# EAGLE design ad (EAGLE 9.3.0)
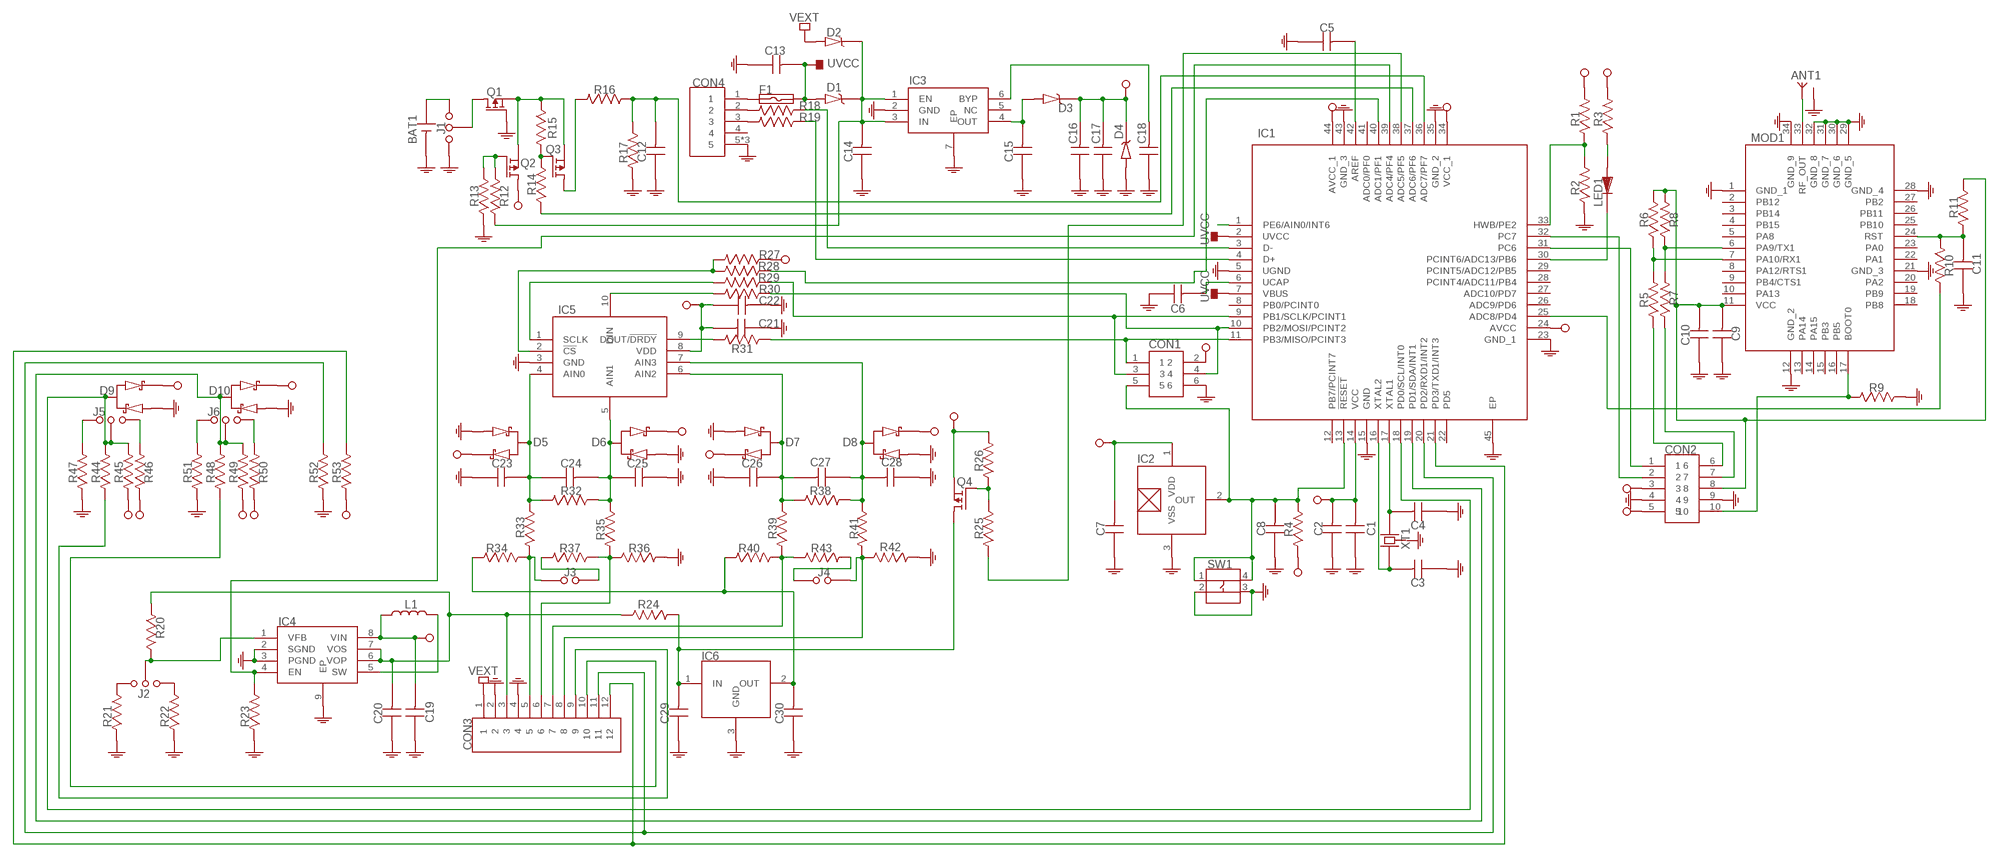
[diagram p0: schematic, sheet 1]

## Parts
ANT1  SMA-RF  [SMA-RF]
BAT1  211P-C-HOLDER  [211P-C-HOLDER]
C1  CAPACITOR-0603  [0603]
C2  CAPACITOR-0603  [0603]
C3  CAPACITOR-0603  [0603]
C4  CAPACITOR-0603  [0603]
C5  CAPACITOR-0603  [0603]
C6  CAPACITOR-0603  [0603]
C7  CAPACITOR-0603  [0603]
C8  CAPACITOR-0603  [0603]
C9  CAPACITOR-0603  [0603]
C10  CAPACITOR-0603  [0603]
C11  CAPACITOR-0603  [0603]
C12  CAPACITOR-0603  [0603]
C13  CAPACITOR-0603  [0603]
C14  CAPACITOR-0805  [0805]
C15  CAPACITOR-0805  [0805]
C16  CAPACITOR-0603  [0603]
C17  CAPACITOR-0603  [0603]
C18  CAPACITOR-0603  [0603]
C19  CAPACITOR-0805  [0805]
C20  CAPACITOR-0805  [0805]
C21  CAPACITOR-0603  [0603]
C22  CAPACITOR-0603  [0603]
C23  CAPACITOR-0603  [0603]
C24  CAPACITOR-0603  [0603]
C25  CAPACITOR-0603  [0603]
C26  CAPACITOR-0603  [0603]
C27  CAPACITOR-0603  [0603]
C28  CAPACITOR-0603  [0603]
C29  CAPACITOR-0603  [0603]
C30  CAPACITOR-0603  [0603]
CON1  ISP  [ISP]
CON2  HEADER-10P-2R-DIP-2_54MM  [HEADER-10P-2R-DIP-2_54MM]
CON3  CON-12P-2_54MM-141V  [CON-12P-2_54MM-141V]
CON4  USB-MICRO-DIP-VER  [USB-MICRO-DIP-VER]
D1  DIODE-SCHOTTKY  [SOD123-DIODE]
D2  DIODE-SCHOTTKY  [SOD123-DIODE]
D3  DIODE-SCHOTTKY  [SOD123-DIODE]
D4  ZENER-SOD123  [SOD123-DIODE]
D5  SCHOTTKY-SERIE-3P  [SOT23-3]
D6  SCHOTTKY-SERIE-3P  [SOT23-3]
D7  SCHOTTKY-SERIE-3P  [SOT23-3]
D8  SCHOTTKY-SERIE-3P  [SOT23-3]
D9  SCHOTTKY-SERIE-3P  [SOT23-3]
D10  SCHOTTKY-SERIE-3P  [SOT23-3]
F1  FUSE-1206  [1206]
IC1  ATMEGA32U4-MU  [QFN-44]
IC2  S-5712-SOT23-3  [SOT23-3]
IC3  MIC5219-VDFN-6  [VDFN-6]
IC4  MCP1640-DFN-8  [DFN-8-2X3]
IC5  ADS1118IRUGT  [X2QFN-10]
IC6  VREF-SOT23-3  [SOT23-3]
J1  JUMPER-3P  [HEADER-3P-DIP-2_54MM]
J2  JUMPER-3P  [HEADER-3P-DIP-2_54MM]
J3  JUMPER  [HEADER-2P-DIP-2_54MM]
J4  JUMPER  [HEADER-2P-DIP-2_54MM]
J5  JUMPER-3P  [HEADER-3P-DIP-2_54MM]
J6  JUMPER-3P  [HEADER-3P-DIP-2_54MM]
L1  INDUCTOR-0520-0630  [INDUCTOR-0520-0630]
LED1  LED-0805  [LED-0805]
MOD1  RAK811  [RAK811]
Q1  P-MOSFET  [SOT23-3]
Q2  P-MOSFET  [SOT23-3]
Q3  P-MOSFET  [SOT23-3]
Q4  P-MOSFET  [SOT23-3]
R1  RESISTOR-0603  [0603]
R2  RESISTOR-0603  [0603]
R3  RESISTOR-0603  [0603]
R4  RESISTOR-0603  [0603]
R5  RESISTOR-0603  [0603]
R6  RESISTOR-0603  [0603]
R7  RESISTOR-0603  [0603]
R8  RESISTOR-0603  [0603]
R9  RESISTOR-0603  [0603]
R10  RESISTOR-0603  [0603]
R11  RESISTOR-0603  [0603]
R12  RESISTOR-0603  [0603]
R13  RESISTOR-0603  [0603]
R14  RESISTOR-0603  [0603]
R15  RESISTOR-0603  [0603]
R16  RESISTOR-0603  [0603]
R17  RESISTOR-0603  [0603]
R18  RESISTOR-0603  [0603]
R19  RESISTOR-0603  [0603]
R20  RESISTOR-0603  [0603]
R21  RESISTOR-0603  [0603]
R22  RESISTOR-0603  [0603]
R23  RESISTOR-0603  [0603]
R24  RESISTOR-0603  [0603]
R25  RESISTOR-0603  [0603]
R26  RESISTOR-0603  [0603]
R27  RESISTOR-0603  [0603]
R28  RESISTOR-0603  [0603]
R29  RESISTOR-0603  [0603]
R30  RESISTOR-0603  [0603]
R31  RESISTOR-0603  [0603]
R32  RESISTOR-0805  [0805]
R33  RESISTOR-0805  [0805]
R34  RESISTOR-0805  [0805]
R35  RESISTOR-0805  [0805]
R36  RESISTOR-0805  [0805]
R37  RESISTOR-0805  [0805]
R38  RESISTOR-0805  [0805]
R39  RESISTOR-0805  [0805]
R40  RESISTOR-0805  [0805]
R41  RESISTOR-0805  [0805]
R42  RESISTOR-0805  [0805]
R43  RESISTOR-0805  [0805]
R44  RESISTOR-0805  [0805]
R45  RESISTOR-0603  [0603]
R46  RESISTOR-0805  [0805]
R47  RESISTOR-0805  [0805]
R48  RESISTOR-0805  [0805]
R49  RESISTOR-0603  [0603]
R50  RESISTOR-0805  [0805]
R51  RESISTOR-0805  [0805]
R52  RESISTOR-0603  [0603]
R53  RESISTOR-0603  [0603]
SW1  BUTTON-4P-SMD-5X5  [BUTTON-4P-SMD-5X5]
XT1  CRYSTAL-5032-4P  [CRYSTAL-5032-4P]

## Nets
GND: ANT1.2(GND) ANT1.3(GND) ANT1.4(GND) ANT1.5(GND) BAT1.2(-) C1.1 C2.1 C3.1 C4.1 C5.1 C6.1 C7.1 C8.1 C9.1 C10.1 C11.1 C12.1 C13.1 C14.1 C15.1 C16.1 C17.1 C18.1 C19.1 C20.1 C21.1 C22.2 C23.1 C25.2 C26.1 C28.1 C29.1 C30.1 CON1.6 CON2.4 CON2.9 CON3.2 CON3.4 CON4.5 CON4.6 CON4.7 D4.2(A) D5.1 D6.1 D7.1 D8.1 D9.1 D10.1 IC1.5(UGND) IC1.15(GND) IC1.23(GND_1) IC1.35(GND_2) IC1.43(GND_3) IC1.45(EP) IC2.3(VSS) IC3.2(GND) IC3.7(EP) IC4.2(SGND) IC4.3(PGND) IC4.9(EP) IC5.3(GND) IC6.3(GND) J1.1 MOD1.1(GND_1) MOD1.12(GND_2) MOD1.21(GND_3) MOD1.28(GND_4) MOD1.29(GND_5) MOD1.30(GND_6) MOD1.31(GND_7) MOD1.32(GND_8) MOD1.34(GND_9) Q1.1(G) R2.1 R9.2 R13.1 R17.1 R21.1 R22.1 R23.1 R36.1 R42.1 R47.1 R51.1 R52.1 SW1.2 SW1.3
N$1: IC5.1(SCLK) R29.2
N$2: C11.2 MOD1.24(RST) R10.1 R11.1
N$3: CON1.1 IC1.11(PB3/MISO/PCINT3) R31.2
N$4: ANT1.1(ANT) MOD1.33(RF_OUT)
N$5: CON3.5 J3.1 R33.1 R34.2
N$6: MOD1.7(PA10/RX1) R5.2 R6.1
N$7: MOD1.6(PA9/TX1) R7.2 R8.1
N$8: IC5.2(!CS) R27.1 R28.2
N$9: CON1.4 IC1.10(PB2/MOSI/PCINT2) R30.2
N$10: C3.2 IC1.16(XTAL2) XT1.1
N$11: CON2.1 IC1.31(PC6)
N$12: C4.2 IC1.17(XTAL1) XT1.3
N$13: C9.2 C10.2 CON2.8 MOD1.11(VCC) R6.2 R8.2 R11.2
N$14: CON2.7 R7.1
N$15: C20.2 CON3.3 IC4.6(VOP) IC4.7(VOS) R20.1 R24.2
N$16: IC1.25(ADC8/PD4) R10.2
N$17: IC5.10(DIN) R30.1
N$18: IC5.9(DOUT/!DRDY) R31.1
N$19: IC1.30(PCINT6/ADC13/PB6) LED1.1(K)
N$20: CON3.7 R39.1 R40.2 R43.2
N$21: CON3.6 R35.1 R36.2 R37.2
N$22: IC4.1(VFB) J2.2 R20.2
N$23: C24.2 C25.1 D6.3 IC5.5(AIN1) R32.2 R35.2
N$24: C23.2 C24.1 D5.3 IC5.4(AIN0) R32.1 R33.2
N$25: CON3.8 J4.1 R41.1 R42.2
N$26: C26.2 C27.2 D7.3 IC5.6(AIN2) R38.2 R39.2
N$27: IC1.40(ADC1/PF1) R28.1
N$28: C29.2 IC6.1(IN) Q4.3(D) R24.1
N$29: CON2.2 IC1.32(PC7)
N$30: C27.1 C28.2 D8.3 IC5.7(AIN3) R38.1 R41.2
N$31: C5.2 IC1.42(AREF)
N$32: Q3.1(G) R14.2 R15.2
N$33: CON4.1 F1.1
N$34: C6.2 IC1.6(UCAP)
N$35: LED1.2(A) R3.1
N$36: C12.2 IC1.36(ADC7/PF7) R16.2 R17.2
N$37: C18.2 IC3.6(BYP)
N$38: C14.2 D1.1(K) D2.1(K) IC3.1(EN) IC3.3(IN) R12.1
N$39: J2.1 R22.2
N$40: C15.2 D3.2(A) IC3.4(OUT)
N$41: CON4.2 R18.1
N$42: CON4.3 R19.1
N$43: IC1.3(D-) R18.2
N$44: IC1.4(D+) R19.2
N$45: CON1.3 IC1.9(PB1/SCLK/PCINT1) R29.1
N$46: Q4.1(G) R25.2 R26.1
N$47: IC1.37(ADC6/PF6) R14.1
N$48: J1.2 Q1.3(D)
N$49: J2.3 R21.2
N$50: IC1.38(ADC5/PF5) R25.1
N$51: BAT1.1(+) J1.3
N$52: D9.3 IC1.18(PD0/SCL/INT0) J5.2 R44.2 R45.2
N$53: Q2.1(G) R12.2 R13.2
N$54: D10.3 IC1.19(PD1/SDA/INT1) J6.2 R48.2 R49.2
N$55: CON3.12 IC1.21(PD3/TXD1/INT3) R53.2
N$56: C30.2 IC6.2(OUT) R34.1 R40.1
N$58: Q1.2(S) Q2.2(S) Q3.2(S) R15.1
N$59: Q3.3(D) R16.1
N$60: CON2.6 R5.1
N$61: IC1.33(HWB/PE2) R1.1 R2.2
N$63: CON2.10 MOD1.17(BOOT0) R9.1
N$64: C8.2 CON1.5 IC1.13(!RESET) IC2.2(OUT) R4.2 SW1.1 SW1.4
N$65: IC4.5(SW) L1.2
N$66: IC1.39(ADC4/PF4) IC4.4(EN) R23.2
N$67: IC1.1(PE6/AIN0/INT6)
N$68: CON3.11 IC1.20(PD2/RXD1/INT2) R52.2
N$69: J4.2 R43.1
N$70: CON3.10 R48.1
N$71: J3.2 R37.1
N$72: CON3.9 R44.1
N$74: J6.1 R51.2
N$75: J6.3 R50.2
N$76: J5.1 R47.2
N$78: J5.3 R46.2
UVCC: C13.2 D1.2(A) F1.2 IC1.2(UVCC) IC1.7(VBUS)
VCC: C1.2 C2.2 C7.2 C16.2 C17.2 C19.2 C21.2 C22.1 CON1.2 CON2.3 CON2.5 D3.1(K) D4.1(K) D5.2 D6.2 D7.2 D8.2 D9.2 D10.2 IC1.14(VCC) IC1.24(AVCC) IC1.34(VCC_1) IC1.44(AVCC_1) IC2.1(VDD) IC4.8(VIN) IC5.8(VDD) L1.1 Q2.3(D) Q4.2(S) R1.2 R3.2 R4.1 R26.2 R27.2 R45.1 R46.1 R49.1 R50.1 R53.1
VEXT: CON3.1 D2.2(A)
Unconnected: CON4.4 IC1.8(PB0/PCINT0) IC1.12(PB7/PCINT7) IC1.22(PD5) IC1.26(ADC9/PD6) IC1.27(ADC10/PD7) IC1.28(PCINT4/ADC11/PB4) IC1.29(PCINT5/ADC12/PB5) IC1.41(ADC0/PF0) IC3.5(NC) MOD1.2(PB12) MOD1.3(PB14) MOD1.4(PB15) MOD1.5(PA8) MOD1.8(PA12/RTS1) MOD1.9(PB4/CTS1) MOD1.10(PA13) MOD1.13(PA14) MOD1.14(PA15) MOD1.15(PB3) MOD1.16(PB5) MOD1.18(PB8) MOD1.19(PB9) MOD1.20(PA2) MOD1.22(PA1) MOD1.23(PA0) MOD1.25(PB10) MOD1.26(PB11) MOD1.27(PB2)

## Power pins joined to a net without a drawn wire
GND: XT1.2(GND) XT1.4(GND)

## Library data of the parts
ANT1 = SamacSys_Parts:SMA-RF
BAT1 = SamacSys_Parts:211P-C-HOLDER
C1-C13 C16-C18 C21-C30 = SamacSys_Parts:CAPACITOR-0603
C14 C15 C19 C20 = SamacSys_Parts:CAPACITOR-0805
CON1 = SamacSys_Parts:ISP
CON2 = SamacSys_Parts:HEADER-10P-2R-DIP-2_54MM
CON3 = SamacSys_Parts:CON-12P-2_54MM-141V
CON4 = SamacSys_Parts:USB-MICRO-DIP-VER
D1-D3 = SamacSys_Parts:DIODE-SCHOTTKY
D4 = SamacSys_Parts:ZENER-SOD123
D5-D10 = SamacSys_Parts:SCHOTTKY-SERIE-3P
F1 = SamacSys_Parts:FUSE-1206
IC1 = SamacSys_Parts:ATMEGA32U4-MU
IC2 = SamacSys_Parts:S-5712-SOT23-3
IC3 = SamacSys_Parts:MIC5219-VDFN-6
IC4 = SamacSys_Parts:MCP1640-DFN-8
IC5 = SamacSys_Parts:ADS1118IRUGT
IC6 = SamacSys_Parts:VREF-SOT23-3
J1 J2 J5 J6 = SamacSys_Parts:JUMPER-3P
J3 J4 = SamacSys_Parts:JUMPER
L1 = SamacSys_Parts:INDUCTOR-0520-0630
LED1 = SamacSys_Parts:LED-0805
MOD1 = SamacSys_Parts:RAK811
Q1-Q4 = SamacSys_Parts:P-MOSFET
R1-R31 R45 R49 R52 R53 = SamacSys_Parts:RESISTOR-0603
R32-R44 R46-R48 R50 R51 = SamacSys_Parts:RESISTOR-0805
SW1 = SamacSys_Parts:BUTTON-4P-SMD-5X5
XT1 = SamacSys_Parts:CRYSTAL-5032-4P

## Board
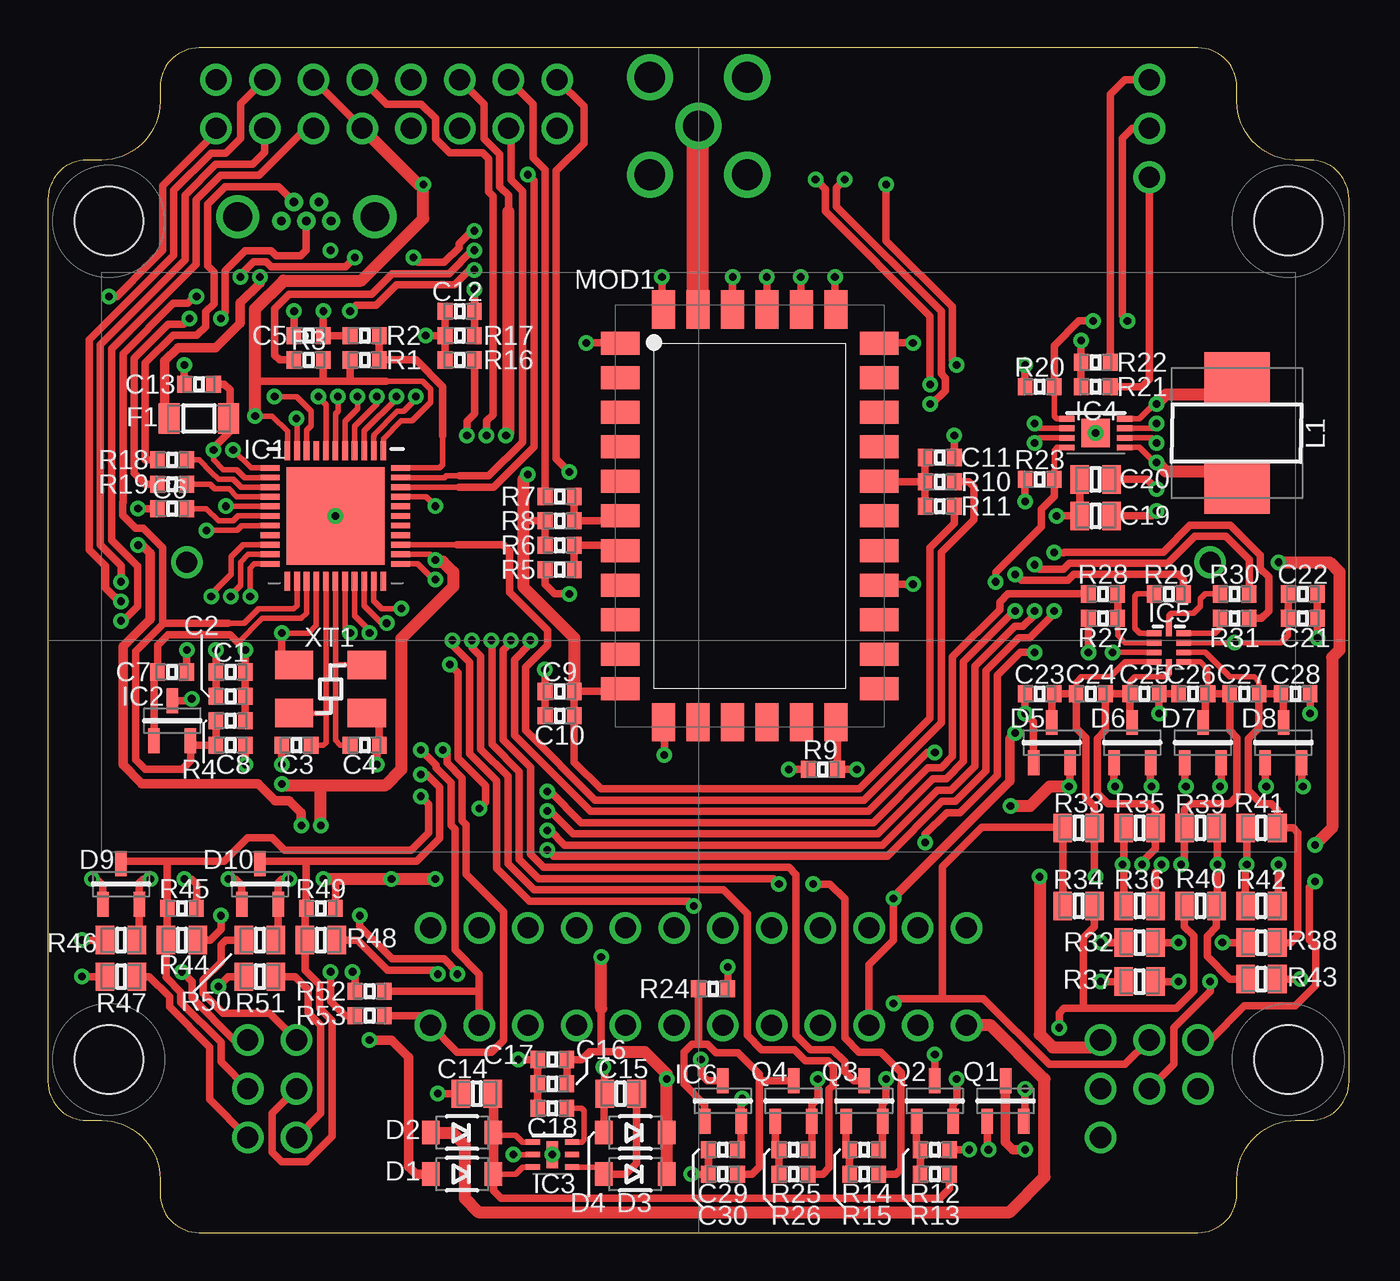
[diagram p1: board, top side]
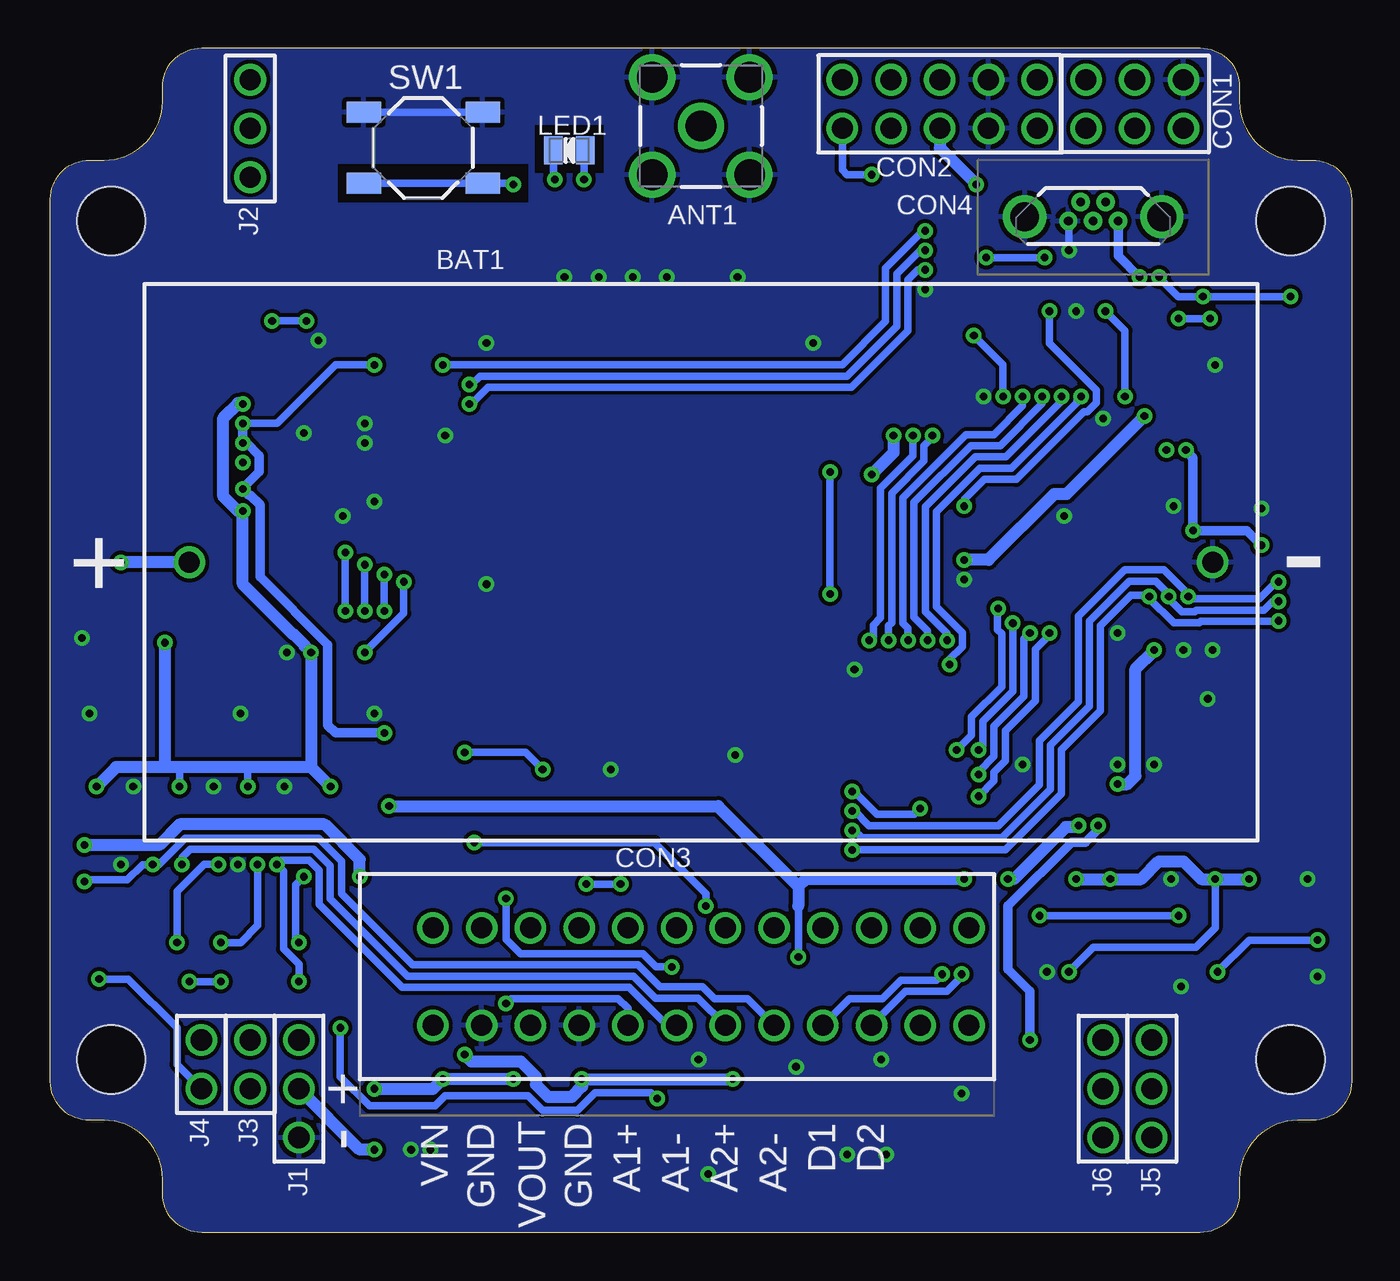
[diagram p2: board, bottom side, seen from below]

Size 67.82 x 61.72 mm. Coordinates in mm from the lower left corner, seen from the top.
Outline: 0,53.85 0,7.87 arc90 2.03,5.84 2.79,5.84 arc-90 5.84,2.79 5.84,2.03 arc90 7.87,0 59.94,0 arc90 61.98,2.03 61.98,2.79 arc-90 65.02,5.84 65.79,5.84 arc90 67.82,7.87 67.82,53.85 arc90 65.79,55.88 65.02,55.88 arc-90 61.98,58.93 61.98,59.69 arc90 59.94,61.72 7.87,61.72 arc90 5.84,59.69 5.84,58.93 arc-90 2.79,55.88 2.03,55.88 arc90 0,53.85
Copper layers (1*16): Top 0.035mm / dielectric 1.5mm / Bottom 0.035mm
Design rules "drc": minimum track width 10mil, minimum drill 0.4mm, track to track 8mil, track to pad 10mil, pad to pad 8mil, via to via 8mil, smd to smd 0mil, copper to edge 0mil, drill to drill 6mil, minimum pad ring 10mil, minimum via ring 8mil, stop-mask expansion 4mil, vias tented up to drill 25mil, thermal gap 10mil
Holes 3.56 mm at 3.17,9.02 64.64,52.7 3.17,52.7 64.64,9.02

### Footprints (pad centres in the part's own frame; a part is rotated, then mirrored left to right if it is on the bottom)
SMA-RF = drill 1.6: 1 0,0; 2 -2.54,2.54; 3 -2.54,-2.54; 4 2.54,-2.54; 5 2.54,2.54
211P-C-HOLDER = drill 1.1: 1 -26.67,0; 2 26.67,0
0603 = smd 0.762 x 0.889: 1 -0.762,0; 2 0.762,0
0805 = smd 0.97 x 1.47: 1 -0.83,0; 2 0.83,0
ISP = drill 1.1 pad 1.65: 1 0,0; 2 2.54,0; 3 0,-2.54; 4 2.54,-2.54; 5 0,-5.08; 6 2.54,-5.08
HEADER-10P-2R-DIP-2_54MM = drill 1.1 pad 1.65: 1 0,0; 2 2.54,0; 3 5.08,0; 4 7.62,0; 5 10.16,0; 6 0,2.54; 7 2.54,2.54; 8 5.08,2.54; 9 7.62,2.54; 10 10.16,2.54
CON-12P-2_54MM-141V = drill 1.1 pad 1.65: 1 -13.97,-2.54; 2 -11.43,-2.54; 3 -8.89,-2.54; 4 -6.35,-2.54; 5 -3.81,-2.54; 6 -1.27,-2.54; 7 1.27,-2.54; 8 3.81,-2.54; 9 6.35,-2.54; 10 8.89,-2.54; 11 11.43,-2.54; 12 13.97,-2.54; 13 -13.97,2.54; 14 -11.43,2.54; 15 -8.89,2.54; 16 -6.35,2.54; 17 -3.81,2.54; 18 -1.27,2.54; 19 1.27,2.54; 20 3.81,2.54; 21 6.35,2.54; 22 8.89,2.54; 23 11.43,2.54; 24 13.97,2.54
USB-MICRO-DIP-VER = drill 0.45: 1 -1.3,0; 2 -0.65,-1; 3 0,0; 4 0.65,-1; 5 1.3,0 | drill 1.5: 6 -3.575,-0.22; 7 3.575,-0.22
SOD123-DIODE = smd 0.91 x 1.22: 1 -1.635,0; 2 1.635,0
SOT23-3 = smd 1.3 x 0.6: 1 -1.05,0.95; 2 -1.05,-0.95; 3 1.05,0
1206 = smd 1.1 x 1.6: 1 -1.55,0; 2 1.55,0
QFN-44 = smd 1 x 0.3: 1 -3.4,2.5; 2 -3.4,2; 3 -3.4,1.5; 4 -3.4,1; 5 -3.4,0.5; 6 -3.4,0; 7 -3.4,-0.5; 8 -3.4,-1; 9 -3.4,-1.5; 10 -3.4,-2; 11 -3.4,-2.5; 23 3.4,-2.5; 24 3.4,-2; 25 3.4,-1.5; 26 3.4,-1; 27 3.4,-0.5; 28 3.4,0; 29 3.4,0.5; 30 3.4,1; 31 3.4,1.5; 32 3.4,2; 33 3.4,2.5 | smd 0.3 x 1: 12 -2.5,-3.4; 13 -2,-3.4; 14 -1.5,-3.4; 15 -1,-3.4; 16 -0.5,-3.4; 17 0,-3.4; 18 0.5,-3.4; 19 1,-3.4; 20 1.5,-3.4; 21 2,-3.4; 22 2.5,-3.4; 34 2.5,3.4; 35 2,3.4; 36 1.5,3.4; 37 1,3.4; 38 0.5,3.4; 39 0,3.4; 40 -0.5,3.4; 41 -1,3.4; 42 -1.5,3.4; 43 -2,3.4; 44 -2.5,3.4 | smd 5.1 x 5.1: 45 0,0
VDFN-6 = smd 0.75 x 0.3: 1 -1.025,0.65; 2 -1.025,0; 3 -1.025,-0.65; 4 1.025,-0.65; 5 1.025,0; 6 1.025,0.65 | smd 0.6 x 1.4: 7 0,0
DFN-8-2X3 = smd 0.8 x 0.3: 1 -1.5,0.75; 2 -1.5,0.25; 3 -1.5,-0.25; 4 -1.5,-0.75; 5 1.5,-0.75; 6 1.5,-0.25; 7 1.5,0.25; 8 1.5,0.75 | smd 1.5 x 1.5: 9 0,0
X2QFN-10 = smd 0.75 x 0.3: 1 -0.775,0.75; 2 -0.775,0.25; 3 -0.775,-0.25; 4 -0.775,-0.75; 6 0.775,-0.75; 7 0.775,-0.25; 8 0.775,0.25; 9 0.775,0.75 | smd 0.3 x 0.8: 5 0,-1; 10 0,1
HEADER-3P-DIP-2_54MM = drill 1.1 pad 1.65: 1 0,-2.54; 2 0,0; 3 0,2.54
HEADER-2P-DIP-2_54MM = drill 1.1 pad 1.65: 1 0,-1.27; 2 0,1.27
INDUCTOR-0520-0630 = smd 2.6 x 3.4: 1 -2.9,0; 2 2.9,0
LED-0805 = smd 0.97 x 1.47: 1 -0.83,0; 2 0.83,0
RAK811 = smd 2 x 1.2: 1 -6.75,9; 2 -6.75,7.2; 3 -6.75,5.4; 4 -6.75,3.6; 5 -6.75,1.8; 6 -6.75,0; 7 -6.75,-1.8; 8 -6.75,-3.6; 9 -6.75,-5.4; 10 -6.75,-7.2; 11 -6.75,-9; 18 6.75,-9; 19 6.75,-7.2; 20 6.75,-5.4; 21 6.75,-3.6; 22 6.75,-1.8; 23 6.75,0; 24 6.75,1.8; 25 6.75,3.6; 26 6.75,5.4; 27 6.75,7.2; 28 6.75,9 | smd 1.2 x 2: 12 -4.5,-10.75; 13 -2.7,-10.75; 14 -0.9,-10.75; 15 0.9,-10.75; 16 2.7,-10.75; 17 4.5,-10.75; 29 4.5,10.75; 30 2.7,10.75; 31 0.9,10.75; 32 -0.9,10.75; 33 -2.7,10.75; 34 -4.5,10.75
BUTTON-4P-SMD-5X5 = smd 1.8 x 1.1: 1 -3.1,1.85; 2 -3.1,-1.85; 3 3.1,-1.85; 4 3.1,1.85
CRYSTAL-5032-4P = smd 2 x 1.5: 1 -1.9,-1.25; 2 1.9,-1.25; 3 1.9,1.25; 4 -1.9,1.25

### Placement (x,y rotation side)
ANT1  33.91,57.66 0 bottom
BAT1  33.91,34.92 0 bottom
C1  9.53,29.21 0 top
C2  9.53,27.94 0 top
C3  12.95,25.4 0 top
C4  16.51,25.4 180 top
C5  13.59,46.74 180 top
C6  6.48,37.72 0 top
C7  6.48,29.21 180 top
C8  9.53,25.4 180 top
C9  26.67,28.19 0 top
C10  26.67,26.92 0 top
C11  46.48,40.39 180 top
C12  21.46,48.01 180 top
C13  7.87,44.2 0 top
C14  22.35,7.24 0 top
C15  29.84,7.24 0 top
C16  26.29,7.75 0 top
C17  26.29,9.02 0 top
C18  26.29,6.48 0 top
C19  54.61,37.34 0 top
C20  54.61,39.24 0 top
C21  65.41,32 180 top
C22  65.41,33.27 0 top
C23  51.69,28.07 0 top
C24  54.36,28.07 0 top
C25  57.15,28.07 0 top
C26  59.69,28.07 0 top
C27  62.36,28.07 180 top
C28  65.02,28.07 180 top
C29  35.18,3.05 0 top
C30  35.18,4.32 0 top
CON1  13.84,57.53 90 bottom
CON2  26.54,57.53 0 bottom
CON3  33.91,13.34 0 bottom
CON4  13.46,52.7 180 bottom
D1  21.59,3.05 180 top
D2  21.59,5.21 180 top
D3  30.61,3.05 180 top
D4  30.61,5.21 180 top
D5  52.32,25.53 90 top
D6  56.52,25.53 90 top
D7  60.2,25.53 90 top
D8  64.39,25.53 90 top
D9  3.81,18.16 90 top
D10  11.05,18.16 90 top
F1  7.87,42.42 0 top
IC1  14.99,37.34 0 top
IC2  6.48,26.67 90 top
IC3  26.29,4.06 0 top
IC4  54.61,41.66 0 top
IC5  58.42,30.48 0 top
IC6  35.18,6.86 90 top
J1  54.86,7.49 0 bottom
J2  57.4,57.53 180 bottom
J3  57.4,8.76 180 bottom
J4  59.94,8.76 180 bottom
J5  10.41,7.49 0 bottom
J6  12.95,7.49 0 bottom
L1  61.98,41.66 270 top
LED1  40.77,56.39 0 bottom
MOD1  36.58,37.34 0 top
Q1  49.91,6.86 90 top
Q2  46.23,6.86 90 top
Q3  42.55,6.86 90 top
Q4  38.86,6.86 90 top
R1  16.51,45.47 180 top
R2  16.51,46.74 0 top
R3  13.59,45.47 0 top
R4  9.53,26.67 180 top
R5  26.67,34.54 0 top
R6  26.67,35.81 180 top
R7  26.67,38.35 0 top
R8  26.67,37.08 180 top
R9  40.39,24.13 180 top
R10  46.48,39.12 0 top
R11  46.48,37.85 0 top
R12  46.23,3.05 180 top
R13  46.23,4.32 180 top
R14  42.55,3.05 180 top
R15  42.55,4.32 180 top
R16  21.46,45.47 180 top
R17  21.46,46.74 180 top
R18  6.48,40.26 0 top
R19  6.48,38.99 0 top
R20  51.69,44.07 0 top
R21  54.61,44.07 0 top
R22  54.61,45.34 0 top
R23  51.69,39.24 0 top
R24  34.67,12.7 0 top
R25  38.86,3.05 180 top
R26  38.86,4.32 0 top
R27  54.99,32 180 top
R28  54.99,33.27 0 top
R29  58.42,33.27 180 top
R30  61.85,33.27 0 top
R31  61.85,32 0 top
R32  56.9,15.11 0 top
R33  53.72,21.08 0 top
R34  53.72,17.02 180 top
R35  56.9,21.08 0 top
R36  56.9,17.02 180 top
R37  56.9,13.08 180 top
R38  63.25,15.11 180 top
R39  60.07,21.08 180 top
R40  60.07,17.02 0 top
R41  63.25,21.08 0 top
R42  63.25,17.02 180 top
R43  63.25,13.21 180 top
R44  6.99,15.24 180 top
R45  6.99,16.89 180 top
R46  3.81,15.24 180 top
R47  3.81,13.34 0 top
R48  14.22,15.24 180 top
R49  14.22,16.89 180 top
R50  11.05,15.24 180 top
R51  11.05,13.34 0 top
R52  16.76,12.57 0 top
R53  16.76,11.3 0 top
SW1  48.39,56.52 180 bottom
XT1  14.73,28.32 0 top

### Tracks (layer width: path | path; a pad name or v marks a point on that pad's centre or on a via)
GND  (via drill 0.4)
  Top 0.292: IC1.43 12.99,42.39 v12.95,42.42 | IC1.35 16.99,41.5 16.99,41.57 18.21,42.79 18.53,42.79 19.18,43.43 v19.18,43.56 | IC1.5 9.28,37.84 v9.27,37.85 | IC1.15 13.99,31.64 13.58,31.24 v12.2,31.24 v12.19,31.24 | IC3.2 v24.26,4.06 | IC5.3 v55.5,30.23 | IC1.23 19.26,34.84 20.07,34.04 v20.19,34.04 | IC4.2 51.69,41.91 v51.44,42.16 | IC4.3 51.69,41.41 v51.44,41.15
  Top 0.381: C3.1 v12.19,24.38 | v17.14,24.38 17.14,25.27 C4.1 17.27,26.43 XT1.2 | C8.1 v10.29,24.38 | C7.1 v7.24,30.35 | IC2.3 7.4,27.72 v7.49,27.81 | v8.76,30.35 C1.1 C2.1 | MOD1.34 32,48.16 v32,49.78 | MOD1.1 29.81,46.35 v28.07,46.35 | MOD1.32 35.68,49.77 v35.69,49.78 | MOD1.31 v37.48,49.77 v37.47,49.78 | MOD1.30 39.24,48.12 v39.24,49.78 | MOD1.29 41.02,48.14 v41.02,49.78 | MOD1.28 43.34,46.35 v45.09,46.35 | MOD1.21 43.37,33.78 v45.09,33.78 | MOD1.12 32.13,26.53 v32.13,24.89 | C10.1 C9.1 v25.91,29.34 | C6.1 v4.7,37.72 | R9.2 v38.61,24.13 | C14.1 v20.32,7.24 | v7.11,45.21 C13.1 | C18.1 C16.1 C17.1 v24.51,9.02 | D4.2 28.97,7.2 C15.1 29.02,8.58 v28.96,8.64 | R17.1 C12.1 v22.23,49.15 | R13.1 v48.01,4.32 | Q1.1 48.96,4.38 v49.02,4.32 | R2.1 C5.1 v14.35,48.01 | C11.1 v47.24,41.53 | C26.1 C25.2 v57.91,27.05 | D6.1 55.56,23.3 v55.63,23.24 | D7.1 59.25,23.3 v59.31,23.24 | D8.1 63.44,23.3 v63.5,23.24 | C22.2 C21.1 v66.17,30.99 | C23.1 v50.93,27.05 51.37,26.6 D5.1 | C28.1 v65.79,27.05 | v12.19,31.24 12.19,30.21 XT1.4 | C30.1 C29.1 v33.53,3.05 | IC6.3 34.38,7.91 34.04,8.26 v34.04,9.02 | C20.1 C19.1 v52.58,37.34 | R23.1 v50.93,38.1 | R21.1 R22.1 v53.85,46.48 | R42.1 64.14,17.08 v64.14,19.18 | R36.1 57.73,18.75 58.04,19.07 v58.04,19.18 | R47.1 v1.78,13.34 | R51.1 9.4,13.34 v8.89,12.83 | v15.88,13.59 16,13.46 R52.1 | D10.1 10.1,18.09 9.78,18.41 v9.4,18.41 | D9.1 2.86,18.09 2.54,18.41 v2.29,18.41
  Bottom 0.381: SW1.2 SW1.3 | CON4.5 14.73,52.67 v14.73,51.18
  other vias: 14.99,37.34 26.29,4.06 54.61,41.66
  pour Bottom: 5.97,2.16 5.97,2.92 arc90 2.92,5.97 2.16,5.97 arc-90 0.13,8 0.13,53.72 arc-90 2.16,55.75 2.92,55.75 arc90 5.97,58.8 5.97,59.56 arc-90 8,61.59 59.82,61.59 arc-90 61.85,59.56 61.85,58.8 arc90 64.9,55.75 65.66,55.75 arc-90 67.69,53.72 67.69,8 arc-90 65.66,5.97 64.9,5.97 arc90 61.85,2.92 61.85,2.16 arc-90 59.82,0.13 8,0.13 arc-90
  cutout Bottom: 42.93,55.63 52.83,55.63 52.83,53.72 42.93,53.72
  cutout Bottom: 38.99,57.66 42.55,57.66 42.55,55.24 38.99,55.24
N$1
  Top 0.292: IC5.1 56.91,31.23 56.64,31.5 56.64,33.15 56.77,33.27 R29.2
N$2
  Top 0.381: R10.1 R11.1 | MOD1.24 43.35,39.12 R10.1 | R10.1 C11.2
N$3  (via drill 0.4)
  Top 0.292: IC1.11 10.76,34.84 10.54,34.62 v10.54,33.15
  Top 0.381: v26.04,19.94 26.36,19.61 43.74,19.61 46.6,22.47 47.3,22.47 48.9,24.06 48.9,29.27 50.61,30.99 51.18,30.99 52.45,32.26 v52.45,32.38 | R31.2 63.25,32 63.63,32.38 63.63,34.16 63.2,34.59 63.2,35.29 61.63,36.85 59.52,36.85 58.13,35.46 52.98,35.46 52.96,35.43 v52.45,35.43 | CON1.1 13.46,57.53 11.01,55.08 8.99,55.08 7.73,53.82 7.73,50.45 3.33,46.04 3.33,38.3 3.32,38.29 3.32,36.07 4.67,34.71 4.67,32.63 3.92,31.88 v3.81,31.88
  Bottom 0.381: v52.45,35.43 v52.45,32.38 | v26.04,19.94 18.03,19.94 15.11,22.86 15.11,25.15 13.08,27.18 13.08,31.62 11.49,33.21 10.54,33.21 v10.54,33.15 10.54,33.04 9.27,31.77 7.94,31.77 7.85,31.85 3.83,31.85 v3.81,31.88
N$4
  Top 1.143: MOD1.33 33.88,56.48 ANT1.1
N$5  (via drill 0.4)
  Top 0.381: R34.2 R33.1 52.86,21.12 48.68,21.12 46.61,19.05 46.61,12.19 | v44.07,11.94 44.32,12.19 46.61,12.19 | 46.61,12.19 48.76,12.19 52.19,8.76 56.13,8.76 J3.1
  Bottom 0.381: CON3.5 37.72,11.68 38.23,12.19 43.81,12.19 v44.07,11.94
N$6
  Top 0.381: R5.2 R6.1 29.55,35.81 MOD1.7
N$7
  Top 0.381: R7.2 R8.1 29.57,37.08 MOD1.6
N$8
  Top 0.292: IC5.2 56.14,30.73 55.75,31.11 R27.1
  Top 0.381: R28.2 R27.1
N$9  (via drill 0.4)
  Top 0.292: IC1.10 10.45,35.34 10.05,34.94 10.05,33.72 9.53,33.2 v9.53,33.15
  Top 0.381: v26.04,20.95 26.16,20.95 26.92,20.19 43.5,20.19 46.36,23.05 47.06,23.05 48.31,24.31 48.31,29.51 50.39,31.59 50.83,31.59 51.44,32.2 v51.44,32.38 | v51.44,34.8 51.66,34.57 52.92,34.57 53.23,34.87 58.37,34.87 59.77,36.27 61.39,36.27 62.61,35.05 R30.2 | CON1.4 11.29,60.07 10.03,58.82 10.03,57.01 9.27,56.25 8.51,56.25 6.57,54.3 6.57,50.93 2.15,46.51 2.15,35.58 3.01,34.72 3.01,33.58 3.48,33.11 3.59,33.11 v3.81,32.89
  Bottom 0.381: v51.44,34.8 v51.44,32.38 | v26.04,20.95 25.91,20.95 25.53,20.57 18.23,20.57 15.7,23.1 15.7,25.39 13.66,27.42 13.66,31.86 11.59,33.94 10.21,33.94 9.53,33.26 v9.53,33.15 9.53,33.04 8.84,32.35 8.18,32.35 8.09,32.44 4.57,32.44 4.11,32.89 v3.81,32.89
N$10
  Top 0.292: IC1.16 14.49,27.05 | 14.49,27.05 14.49,25.54 14.35,25.4 C3.2 | XT1.1 12.85,27.05 14.49,27.05
N$11  (via drill 0.4)
  Top 0.292: 21.44,38.84 IC1.31
  Top 0.381: v25.02,55.12 25.32,54.81 25.32,40.95 23.22,38.84 21.44,38.84
  Bottom 0.381: v25.02,55.12 26.29,55.12 26.54,55.37 CON2.1
N$12
  Top 0.292: IC1.17 14.99,29.59 | 14.99,29.59 14.99,25.65 15.24,25.4 C4.2 | XT1.3 16.61,29.59 14.99,29.59
N$13  (via drill 0.4)
  Top 0.381: MOD1.11 29.68,28.19 C9.2 C10.2 27.43,24.51 28.83,23.11 42.29,23.11 45.97,26.8 45.97,35.69 47.24,36.96 R11.2 | R6.2 R8.2 24.77,37.08 | CON2.8 22.73,58.8 22.73,57.01 23.55,56.19 23.55,54.49 24,54.04 24,53.21
  Top 0.635: v23.88,41.53 24,41.66 24,53.21 | v25.02,39.5 24.77,39.24 24.77,37.08 24.77,33.66 27.43,30.99 C9.2
  Bottom 0.635: v23.88,41.53 23.88,40.64 v25.02,39.5
N$14
  Top 0.381: CON2.7 25.27,58.8 25.27,56.01 25.91,55.37 R7.1
N$15  (via drill 0.4)
  Top 0.292: IC4.6 57.53,41.41 v57.78,41.15 | IC4.7 57.53,41.91 v57.78,42.16
  Top 0.381: R20.1 v50.93,45.21 | v57.78,38.73 57.28,39.24 C20.2 | CON3.3 42.8,13.95 44.07,15.22 v44.07,17.4 | R24.2 v35.43,13.84
  Top 0.508: v50.42,26.04 50.13,25.74 50.13,23.51 44.07,17.45 v44.07,17.4
  Bottom 0.381: v57.78,42.16 56.01,42.16 52.96,45.21 v50.93,45.21 | v35.43,13.84 36.26,13.84 36.94,14.53 43.31,14.53 44.07,15.29 v44.07,17.4
  Bottom 0.508: v50.42,26.04 52.96,26.04 53.37,26.45 53.37,30.64 56.9,34.16 56.9,37.92 57.43,38.45 57.5,38.45 v57.78,38.73 57.78,38.79 56.92,39.65 56.92,40.49 57.58,41.15 v57.78,41.15 v57.78,42.16
N$16
  Top 0.292: 21.31,35.84 IC1.25
  Top 0.381: R10.2 48.01,39.12 48.26,38.86 48.26,37.15 46.56,35.45 46.56,26.55 42.53,22.53 28.52,22.53 24.89,26.16 24.89,29.46 26.04,30.61 26.04,31.38 24.05,33.36 24.05,35.51 23.73,35.84 21.31,35.84
N$17
  Top 0.292: IC5.10 58.42,32.13 58.55,32.26 59.69,32.26 60.07,32.64 60.07,33.02 60.33,33.27 R30.1
N$18
  Top 0.292: IC5.9 60.82,31.23 61.09,31.5 R31.1
N$19  (via drill 0.4)
  Top 0.292: IC1.30 19.7,38.34 v20.19,37.85
  Top 0.381: v15.75,48.01 16.05,48.31 17.12,48.31 18.18,49.38 21.2,49.38 21.99,50.16 v22.23,50.16 | v41.53,54.86 41.1,54.43 41.1,53.45 46.56,47.99 46.56,44.74 46.77,44.53 46.77,43.87 46.09,43.18 v45.97,43.18
  Bottom 0.381: v15.75,48.01 15.75,46.34 13.3,43.89 13.3,43.23 13.77,42.76 13.96,42.76 17.48,39.24 19.13,39.24 20.17,38.2 20.17,37.87 v20.19,37.85 | v22.23,50.16 22.59,50.16 23.11,49.64 23.11,46.99 26.06,44.04 45,44.04 45.86,43.18 v45.97,43.18 | LED1.1 41.6,54.93 v41.53,54.86
N$20  (via drill 0.4)
  Top 0.381: R39.1 60.96,21.02 v60.96,19.18 60.96,17.08 R40.2 60.9,15.93 60.42,15.44 60.42,14.39 61.59,13.21 R43.2
  Bottom 0.381: CON3.7 34.06,12.22 36.28,12.22 37.43,13.36 49.19,13.36 53.23,17.4 53.23,19.11 54.09,19.97 60.54,19.97 60.96,19.56 v60.96,19.18
N$21  (via drill 0.4)
  Top 0.381: R35.1 56.07,19.24 v56.01,19.18 56.07,19.12 R36.2 | R37.2 v54.86,13.08
  Bottom 0.381: CON3.6 35.69,10.79 37.67,12.78 49.48,12.78 53.81,17.11 53.81,18.87 54.33,19.39 55.79,19.39 v56.01,19.18 55.66,18.83 55.66,14.78 54.86,13.99 v54.86,13.08
N$22  (via drill 0.4)
  Top 0.292: IC4.1 52.59,42.41 52.45,42.55 R20.2
  Top 0.381: R20.2 52.45,46.21 53.74,47.5 v54.48,47.5 | v56.26,47.5 55.99,47.77 55.99,57.01 56.52,57.53 J2.2
  Bottom 0.381: v54.48,47.5 v56.26,47.5
N$23  (via drill 0.4)
  Top 0.292: IC5.5 58.42,29.08 58.29,28.96 56.64,28.96 56.39,28.7 C25.1
  Top 0.381: D6.3 56.39,26.7 C25.1 C24.2 55.12,26.16 54.69,25.74 54.69,22.9 55.24,22.35 57.4,22.35 57.73,22.03 R35.2 57.73,20.01 57.02,19.3 v57.02,19.18 | R32.2 v58.93,15.11
  Bottom 0.381: v58.93,15.11 57.91,15.11 57.02,16 v57.02,19.18
N$24  (via drill 0.4)
  Top 0.292: IC5.4 56.15,29.73 55.37,28.96 53.85,28.96 53.59,28.7 C24.1
  Top 0.381: D5.3 52.32,27.94 C23.2 C24.1 53.59,26.29 54.11,25.77 54.11,22.66 54.55,22.22 R33.2 54.55,18.6 v54.61,18.54 | R32.1 v54.86,15.11
  Bottom 0.381: v54.86,15.11 55.03,15.28 55.03,18.12 v54.61,18.54
N$25  (via drill 0.4)
  Top 0.381: R42.2 62.42,19.11 v62.48,19.18 62.48,21.01 R41.1 | v66.04,18.29 65.73,17.98 65.73,15.25 66.08,14.91 66.08,12.88 66.04,12.84 66.04,12.83 65.02,11.81 62.36,11.81 60.58,10.03 J4.1
  Bottom 0.381: v66.04,18.29 65.95,18.38 63.8,18.38 63.01,19.18 v62.48,19.18 62.17,19.18 60.79,20.56 53.85,20.56 52.65,19.36 52.65,17.65 48.94,13.95 37.18,13.95 36.04,12.8 33.82,12.8 33.21,12.19 31.5,12.19 CON3.8
N$26  (via drill 0.4)
  Top 0.292: IC5.6 60.06,29.73 60.45,29.34 C26.2
  Top 0.381: D7.3 60.33,26.7 60.33,27.94 C26.2 C27.2 61.59,26.16 61.98,25.78 61.98,22.73 61.59,22.35 59.56,22.35 59.24,22.03 R39.2 59.24,19.36 v59.05,19.18 | R38.2 v61.21,15.11
  Bottom 0.381: v61.21,15.11 61.21,17.78 59.8,19.19 59.07,19.19 v59.05,19.18
N$27  (via drill 0.4)
  Top 0.292: v14.1,43.56 14.1,43.51 14.49,43.12 IC1.40
  Top 0.381: R28.1 50.04,33.27 49.61,32.84 49.61,32.46 47.14,30 47.14,24.81 46.56,24.22 45.88,24.22 43.02,21.36 27.79,21.36 26.16,22.99 v26.04,22.99 | v20.95,29.59 21.39,29.16 21.39,24.71 22.81,23.29 22.81,22.43 v22.48,22.1
  Bottom 0.381: v14.1,43.56 14.32,43.34 14.32,43.23 17.72,39.83 19.37,39.83 21.63,37.56 21.63,32.6 20.29,31.25 20.29,30.53 20.95,29.86 v20.95,29.59 | v22.48,22.1 22.78,21.79 24.73,21.79 25.92,22.99 v26.04,22.99
N$28
  Top 0.381: C29.2 36.7,3.05 37.08,3.43 37.08,7.91 | IC6.1 34.23,6.67 33.15,7.75 33.15,9.4 33.56,9.81 33.91,9.81 | 33.91,9.81 34.37,9.81 34.82,9.36 35.98,9.36 37.08,8.26 37.08,7.91 | Q4.3 37.08,7.91 | R24.1 33.91,9.81
N$29
  Top 0.292: IC1.32 20.67,39.34 20.75,39.42 21.46,39.42
  Top 0.381: CON2.2 24.13,57.4 24.13,54.86 24.74,54.25 24.74,41.19 22.98,39.42 21.46,39.42
N$30
  Top 0.292: IC5.7 60.32,30.23 61.59,28.96 62.87,28.96 63.12,28.7 C27.1
  Top 0.381: D8.3 64.39,27.94 C28.2 C27.1 63.12,26.29 62.56,25.73 62.56,23.04 63.25,22.35 63.75,22.35 64.08,22.03 R41.2 64.9,21.08 65.15,20.83 65.15,15.49 64.77,15.11 R38.1
N$31  (via drill 0.4)
  Top 0.292: IC1.42 13.49,41.81 13.72,42.04 13.72,42.8 12.95,43.56 v11.81,43.56
  Top 0.381: C5.2 v12.83,48.01
  Bottom 0.381: v11.81,43.56 11.81,46.99 v12.83,48.01
N$32
  Top 0.381: Q3.1 41.59,4.51 R15.2 R14.2
N$33  (via drill 0.4)
  Top 0.508: F1.1 6.1,42.65 6.1,45.41 6.78,46.1 8.75,46.1 10.02,47.37 10.02,48.44 11.05,49.47 v11.05,49.78
  Bottom 0.508: CON4.1 12.16,50.9 v11.05,49.78
N$34
  Top 0.292: IC1.6 9.91,37.34 9.65,37.08 8.89,37.08 8.26,37.72 C6.2
N$35  (via drill 0.4)
  Top 0.381: R3.1 12.06,45.47 11.81,45.72 11.81,48.13 12.57,48.9 16.88,48.9 17.94,49.96 20.89,49.96 22.11,51.18 v22.23,51.18 | v40.01,54.86 40.51,54.36 40.51,53.21 45.97,47.75 v45.97,44.2
  Bottom 0.381: v22.23,51.18 22.46,51.18 23.7,49.95 23.7,47.23 26.3,44.63 45.43,44.63 45.86,44.2 v45.97,44.2 | LED1.2 40.01,56.32 v40.01,54.86
N$36  (via drill 0.4)
  Top 0.292: IC1.36 16.49,41.63 16.49,41.64 16.49,41.77 18.16,43.44 v18.16,43.56
  Top 0.381: R16.2 R17.2 | R17.2 C12.2 | R17.2 v19.68,46.74
  Bottom 0.381: v19.68,46.74 18.16,45.21 v18.16,43.56
N$37
  Top 0.292: IC3.6 27.83,4.71 27.94,4.83 27.94,6.35 27.81,6.48 C18.2
N$38
  Top 0.292: IC3.1 24.75,4.71 24.38,5.08 23.35,5.08 D2.1 | IC3.3 24.75,3.41 24.38,3.05 D1.1
  Top 0.381: R12.1 46.99,2.29 46.48,1.78 23.62,1.78 23.23,2.17 D1.1
  Top 0.508: D1.1 D2.1 23.23,7.2 C14.2
N$39
  Top 0.381: J2.1 56.13,60.07 55.37,59.31 R22.2
N$40
  Top 0.292: IC3.4 28.61,3.41 D3.2
  Top 0.381: C15.2 30.68,3.62 30.1,3.05 D3.2
N$41
  Top 0.381: CON4.2 12.02,54.49 9.24,54.49 8.32,53.58 8.32,50.37 8.65,50.03 8.65,48.4 8.22,47.97 8.22,47.95 8.22,47.21 7.76,46.75 6.52,46.75 5.08,45.31 5.08,40.26 R18.1
N$42  (via drill 0.4)
  Top 0.381: R19.1 5.08,38.99 4.5,39.57 4.5,45.55 6.27,47.33 7.07,47.33 v7.37,47.62 | CON4.3 13.46,51.18 13.18,50.9 11.88,50.9 11.62,51.16 10.29,51.16 9.24,50.11 9.24,47.96 9.02,47.74 v9.02,47.62
  Bottom 0.381: v9.02,47.62 v7.37,47.62
N$43
  Top 0.292: IC1.3 10.06,38.84 9.65,39.24 8.89,39.24 8.51,39.62 7.87,40.26 R18.2
N$44
  Top 0.292: IC1.4 9.84,38.34 9.43,38.75 8.69,38.75 8.44,38.99 R19.2
N$45  (via drill 0.4)
  Top 0.292: IC1.9 10.18,35.84 9.55,35.2 9.55,34.29 8.51,33.25 v8.51,33.15
  Top 0.381: v26.04,21.97 26.16,21.97 27.36,20.78 43.26,20.78 46.12,23.64 46.82,23.64 47.73,24.55 47.73,29.75 50.36,32.38 v50.42,32.38 | R29.1 59.18,34.04 58.93,34.29 53.47,34.29 53.16,33.98 50.72,33.98 v50.42,34.29 | CON1.3 11.3,56.3 10.67,55.66 8.75,55.66 7.15,54.06 7.15,50.69 2.73,46.27 2.73,35.83 3.81,34.75 v3.81,33.91
  Bottom 0.381: v50.42,34.29 v50.42,32.38 | v26.04,21.97 25.91,21.97 25.15,21.21 18.42,21.21 16.28,23.34 16.28,25.63 14.25,27.66 14.25,32.11 11.83,34.53 9.78,34.53 8.51,33.26 v8.51,33.15 8.38,33.02 4.81,33.02 3.92,33.91 v3.81,33.91
N$46
  Top 0.381: R25.2 R26.1 37.91,4.51 Q4.1
N$47  (via drill 0.4)
  Top 0.292: IC1.37 15.99,42.02 17.14,43.18 v17.14,43.56
  Top 0.381: R14.1 44.2,3.05 44.45,3.3 44.45,7.64 44.48,7.67 44.48,8.33 43.42,9.4 42.27,9.4 41.53,10.14 41.53,17.4 40.77,18.16 v39.88,18.16 | v38.1,18.16 37.82,18.44 25.58,18.44 24.56,19.46 24.56,24.01 23.14,25.44 23.14,30.84 v23.11,30.86
  Bottom 0.381: v39.88,18.16 v38.1,18.16 | v17.14,43.56 17.14,43.07 18.63,41.58 20.09,41.58 23.38,38.29 23.38,31.75 23.11,31.48 v23.11,30.86
N$48  (via drill 0.4)
  Top 0.508: Q1.3 49.91,4.7 50.29,4.32 v50.93,4.32
  Bottom 0.635: v50.93,4.32 51.69,4.32 J1.2
N$49
  Top 0.381: R21.2 57.02,44.07 57.4,44.45 J2.3
N$50  (via drill 0.4)
  Top 0.292: IC1.38 15.49,42.28 16.13,42.93 v16.13,43.56
  Top 0.381: v22.1,30.86 22.1,30.48 22.55,30.02 22.55,25.19 23.98,23.77 23.98,19.22 25.34,17.86 35.21,17.86 36.45,16.62 36.45,10.27 37.19,9.53 38.91,9.53 39.49,8.94 40.65,8.94 40.93,8.66 40.93,7.67 40.72,7.46 40.72,3.38 40.39,3.05 R25.1
  Bottom 0.381: v16.13,43.56 16.13,43.18 18.31,41 19.85,41 22.8,38.05 22.8,32.05 22.1,31.35 v22.1,30.86
N$51  (via drill 0.4)
  Top 0.635: v64.14,34.92 66.8,34.92 67.31,34.42 67.31,30.35 66.93,29.97 66.93,21.08 v66.04,20.19 | v51.69,18.54 51.69,10.33 52.37,9.65 54.48,9.65 J1.3
  Bottom 0.635: BAT1.1 v64.14,34.92 | v51.69,18.54 51.69,19.43 53.53,21.27 61.08,21.27 62.16,20.19 v66.04,20.19
N$52  (via drill 0.4)
  Top 0.292: IC1.18 15.49,31.5 v15.75,31.24
  Top 0.381: D9.3 3.94,19.34 6.22,19.34 | v19.43,22.73 19.84,22.33 19.84,20.83 18.93,19.92 12.34,19.92 11.68,20.57 10.41,20.57 9.18,19.34 6.22,19.34 | 6.22,19.34 R45.2 6.22,15.31 R44.2 6.16,13.29 6.92,12.52 6.92,12 9.02,9.9 9.02,8.89 J5.2
  Bottom 0.381: v19.43,22.73 18.63,23.53 18.63,23.99 18.05,24.57 18.05,26.15 16.48,27.71 16.48,30.39 15.75,31.13 v15.75,31.24
N$53
  Top 0.381: Q2.1 45.28,4.51 R13.2 R12.2
N$54  (via drill 0.4)
  Top 0.292: IC1.19 15.99,32.15 16.76,31.37 v16.76,31.24
  Top 0.381: D10.3 11.18,19.34 13.46,19.34 | v19.43,23.88 19.74,23.88 20.42,23.2 20.42,20.55 19.21,19.34 13.46,19.34 | 13.46,19.34 R49.2 13.39,16.82 R48.2 13.39,13.66 14.15,12.9 14.15,11.7 14.81,11.04 14.81,5.01 13.48,3.68 12.19,3.68 11.68,4.19 11.68,6.22 J6.2
  Bottom 0.381: v19.43,23.88 19.43,24.02 18.63,24.82 18.63,26.39 17.07,27.95 17.07,30.94 v16.76,31.24
N$55  (via drill 0.4)
  Top 0.292: IC1.21 16.99,32.92 17.4,32.51 v18.41,32.51
  Top 0.381: v20.57,25.15 20.8,24.92 20.8,24.47 21.59,23.68 21.59,21.46 21.79,21.26 21.79,18.67 23.75,16.71 23.75,10.03 23.11,9.4 21.34,9.4 CON3.12 19.43,11.3 R53.2
  Bottom 0.381: v20.57,25.15 19.8,25.92 19.8,26.87 18.24,28.44 18.24,31.21 18.45,31.42 18.45,32.48 v18.41,32.51
N$56  (via drill 0.4)
  Top 0.381: R34.1 54.55,15.94 53.98,15.37 53.98,11.68 | 53.98,11.68 52.96,11.68 52.7,11.43 v52.7,10.67 | 53.98,11.68 58.8,11.68 59.73,12.61 59.73,15.46 59.24,15.94 R40.1 | C30.2 36.13,4.51 IC6.2 36.13,6.92 v36.2,6.99
  Bottom 0.381: v36.2,6.99 36.5,7.29 39.42,7.29 40.34,6.37 42.17,6.37 42.92,7.12 47.25,7.12 47.76,6.6 51.18,6.6 52.7,8.13 v52.7,10.67
N$58  (via drill 0.4)
  Top 0.381: R15.1 43.49,4.51 Q3.2 43.49,6.67 43.69,6.86 v43.69,8 | Q2.2 47.18,6.67 47.37,6.86 v47.37,8 | v50.93,7.49 50.93,5.87 Q1.2
  Bottom 0.635: v43.69,8 v47.37,8 47.88,7.49 v50.93,7.49
N$59  (via drill 0.4)
  Top 0.381: R16.1 22.23,42.66 21.84,42.27 v21.84,41.53 | v24.13,30.86 24.13,30.75 23.72,30.34 23.72,25.68 25.15,24.26 25.15,19.7 25.82,19.02 38.62,19.02 38.99,18.65 38.99,10.27 39.73,9.53 40.89,9.53 41.53,8.89 41.53,8.38 42,7.91 Q3.3
  Bottom 0.381: v24.13,30.86 24.13,31.62 23.97,31.79 23.97,38.53 22.28,40.22 22.28,40.99 21.84,41.42 v21.84,41.53
N$60  (via drill 0.4)
  Top 0.381: CON2.6 27.94,58.67 27.94,56.77 26.49,55.32 26.49,40.31 v27.18,39.62 | R5.1 25.91,33.78 26.42,33.27 v27.18,33.27
  Bottom 0.381: v27.18,33.27 v27.18,39.62
N$61
  Top 0.292: IC1.33 20.41,39.84 20.57,40.01 20.57,41.53
  Top 0.381: R2.2 R1.1 19.18,45.47 20.57,44.07 20.57,41.53
N$63  (via drill 0.4)
  Top 0.381: MOD1.17 41.15,26.52 R9.1 v42.16,24.13 | CON2.10 17.65,58.8 19.45,58.8 20.19,58.06 20.19,57.01 20.94,56.26 22.65,56.26 22.96,55.95 22.96,54.24 23.19,54.01 23.19,42.62 22.86,42.29 v22.86,41.53 | v46.23,25.02 45.85,25.02 42.77,21.95 28.28,21.95 24.31,25.92 24.31,29.86 25.15,30.7 v25.15,30.86
  Bottom 0.381: v46.23,25.02 43.05,25.02 v42.16,24.13 | v25.15,30.86 24.93,31.08 24.93,31.65 24.55,32.03 24.55,38.77 22.86,40.47 v22.86,41.53
N$64  (via drill 0.4)
  Top 0.292: IC1.13 12.99,32.67 12.81,32.5 10.97,32.5 10.22,31.75 9.4,31.75
  Top 0.381: R4.2 C8.2 7.65,25.4 IC2.2 7.43,24.57 6.99,24.13 5.08,24.13 4.57,24.64 4.57,30.29 6.03,31.75 | CON1.5 8.76,57.33 5.98,54.54 5.98,51.18 5.33,50.53 5.33,50.52 3.58,48.77 v3.17,48.77 | v16,50.8 15.52,50.32 11.64,50.32 11.38,50.58 10.72,50.58 10.03,49.9 v10.03,49.78 | v7.75,48.77 7.62,48.77 7.27,48.42 6.54,48.42 3.91,45.8 3.91,38.06 3.9,38.05 3.9,37.37 4.57,36.7 4.95,36.7 4.95,36.69 5.97,35.67 5.97,31.81 6.03,31.75 | 6.03,31.75 9.4,31.75 | v19.05,50.8 19.3,50.55 20.65,50.55 21.43,51.32 21.43,51.51 22.11,52.2 v22.23,52.2 | v47.37,45.21 47.14,45.44 47.14,48.24 43.69,51.69 v43.69,54.61
  Bottom 0.381: SW1.4 SW1.1 43.74,54.66 v43.69,54.61 | v19.05,50.8 v16,50.8 | v10.03,49.78 9.02,48.77 v7.75,48.77 v3.17,48.77 | v22.23,52.2 22.34,52.2 24.28,50.25 24.28,47.47 26.54,45.21 v47.37,45.21
N$65  (via drill 0.4)
  Top 0.292: IC4.5 56.88,40.91 57.66,40.13 v57.78,40.13
  Top 0.635: L1.2 61.85,38.76 60.96,39.65 58.27,39.65 v57.78,40.13
N$66  (via drill 0.4)
  Top 0.292: IC1.39 14.99,42.67 15.11,42.8 v15.11,43.56 | IC4.4 52.59,40.91 52.45,40.77 R23.2
  Top 0.381: v21.08,30.86 21.08,30.61 21.97,29.72 21.97,24.95 23.39,23.53 23.39,18.98 25.1,17.27 33.4,17.27 v33.66,17.02 | v45.72,20.32 45.72,20.76 46.85,21.89 47.54,21.89 49.48,23.82 49.48,29.03 50.68,30.23 v51.44,30.23 | R23.2 52.45,38.35 51.78,37.68 51.78,36.78 49.4,34.4 v49.4,33.91
  Bottom 0.381: v15.11,43.56 15.11,43.32 18.02,40.41 19.61,40.41 22.21,37.81 22.21,32.36 21.08,31.23 v21.08,30.86 | v33.66,17.02 33.66,17.65 36.32,20.32 v45.72,20.32 | v51.44,30.23 49.4,32.26 v49.4,33.91
N$67  (via drill 0.4)
  Top 0.292: IC1.1 10.58,39.84 v9.65,40.77
N$68  (via drill 0.4)
  Top 0.292: IC1.20 16.49,32.66 17.4,31.75 v17.65,31.75
  Top 0.381: v19.43,25.15 20.22,24.36 20.22,24.23 21.01,23.44 21.01,21.22 21.21,21.02 21.21,15.88 21.21,14.73 22.48,13.46 22.48,12.57 | CON3.11 22.48,12.57 | R52.2 22.48,12.57
  Bottom 0.381: v19.43,25.15 19.22,25.36 19.22,26.63 17.65,28.2 v17.65,31.75
N$69  (via drill 0.4)
  Top 0.381: R43.1 v65.28,13.21
  Bottom 0.381: v65.28,13.21 63.75,13.21 61.21,10.67 61.21,8.74 59.96,7.49 J4.2
N$70  (via drill 0.4)
  Top 0.381: v20.32,13.46 20.11,13.68 17.71,13.68 16.14,15.24 R48.1
  Bottom 0.381: CON3.10 23.24,12.57 21.1,12.57 20.32,13.35 v20.32,13.46
N$71  (via drill 0.4)
  Top 0.381: R37.1 v58.93,13.08 | J3.2 58.67,8.76 58.67,10.67 60.58,12.57 v60.58,13.08
  Bottom 0.381: v58.93,13.08 v60.58,13.08
N$72  (via drill 0.4)
  Top 0.381: R44.1 8.45,15.24 9.02,15.81 v9.02,16.51 | v21.34,13.46 21.34,13.57 20.65,14.26 17.95,14.26 16.26,15.95 v16.26,16.51
  Bottom 0.381: v9.02,16.51 v16.26,16.51 | CON3.9 26.16,12.19 24.45,12.19 23.48,13.16 21.64,13.16 v21.34,13.46
N$74
  Top 0.381: J6.1 14.22,6.22 14.22,10.79 13.56,11.46 13.56,12.66 12.89,13.34 R51.2
N$75
  Top 0.381: R50.2 9.27,15.24 9.02,14.99 9.02,14.1 8.09,13.17 8.09,12.48 9.14,11.43 11.56,11.43 J6.3
N$76
  Top 0.381: R47.2 5.29,13.34 6.34,12.28 6.34,11.76 8.43,9.66 8.43,6.93 J5.1
N$78  (via drill 0.4)
  Top 0.381: J5.3 9.71,10.03 7.51,12.24 7.51,13.06 v6.99,13.59 | R46.2 v1.78,15.24
  Bottom 0.381: v6.99,13.59 5.33,15.24 v1.78,15.24
UVCC  (via drill 0.4)
  Top 0.292: IC1.7 10.11,36.84 9.86,36.59 v8.27,36.59 v8.26,36.58 | IC1.2 10.26,39.34 9.84,39.75 9.14,39.75 8.64,40.26 v8.64,40.77
  Top 0.381: v8.64,40.77 8.64,40.89 9.47,41.72 9.47,42.38 | C13.2 9.19,44.2 9.48,43.9 9.48,42.48 F1.2
  Top 0.508: 9.47,42.38 F1.2 | v4.7,35.81 4.91,35.81 5.32,35.4 5.32,31.95 3.92,30.56 3.92,24.37 4.9,23.4 10.95,23.4 11.84,22.51 12.57,22.51 13.21,21.87 v13.21,21.21 | D1.2 19.18,3.05 18.8,3.43 18.8,9.14 17.91,10.03 v16.76,10.03
  Bottom 0.508: v8.64,40.77 8.64,40.71 8.28,40.36 8.28,36.6 v8.26,36.58 5.46,36.58 v4.7,35.81 | v16.76,10.03 16.76,12.57 17.91,13.72 17.91,17.02 14.58,20.35 13.87,20.35 13.21,21.01 v13.21,21.21
VCC  (via drill 0.4)
  Top 0.292: IC1.14 13.49,32.28 13.21,32 11.18,32 9.91,30.73 | IC1.24 19.91,35.34 v20.19,35.05 | IC1.44 12.49,41.74 11.68,42.55 v10.79,42.55 | IC1.34 17.49,41.36 18.41,42.29 18.97,42.29 19.94,43.26 19.94,43.94 19.52,44.36 17.62,44.36 | C21.2 64.64,31.11 64.26,30.73 64.25,30.73 v61.85,30.73 IC5.8 | IC4.8 56.88,42.41 57.66,43.18 v57.78,43.18
  Top 0.381: IC2.1 5.53,29.02 C7.2 5.71,30.61 6.26,31.15 9.49,31.15 9.91,30.73 v10.29,30.35 C1.2 C2.2 R4.1 | C16.2 C17.2 27.81,9.02 28.23,9.43 28.83,9.43 | R26.2 39.81,4.51 Q4.2 39.81,6.67 40.13,6.99 v40.13,8 | Q2.3 v46.23,9.27 | CON1.2 CON2.5 | 17.62,44.36 15.75,44.36 | 15.75,44.36 14.35,44.36 | R1.2 15.75,44.36 | R3.2 14.35,44.36 | D5.2 53.27,23.3 v53.21,23.24 | D6.2 57.47,23.31 v57.53,23.24 | D7.2 61.15,23.3 v61.09,23.24 | D8.2 65.34,23.31 v65.41,23.24 | C22.1 C21.2 | R27.2 v54.23,30.23 | 10.79,44.58 11.01,44.36 14.35,44.36 | v57.78,37.59 57.53,37.34 C19.2 | 29.72,9.4 29.68,9.43 28.83,9.43 | 28.83,9.43 28.83,11.68 | R46.1 4.76,15.36 D9.2 4.76,18.22 4.95,18.41 v5.33,18.41 | R50.1 12,15.36 D10.2 12,18.22 12.19,18.41 v12.57,18.41 | v7.11,18.41 7.49,18.41 7.75,18.16 R45.1 | R53.1 15.49,11.3 14.73,12.06 v14.73,13.59 | R49.1 14.99,18.41
  Top 0.635: D3.1 D4.1 32.24,7.99 v32.26,8 32.26,8.26 31.11,9.4 29.72,9.4 | v10.79,42.55 10.79,44.58 10.79,48.12 12.28,49.61 16.33,49.61 19.56,52.83 v19.56,54.61 19.3,54.61 CON2.5 | v53.21,23.24 52.2,23.24 51.18,22.23 v50.16,22.23 | v57.78,43.18 58.27,43.67 61.09,43.67 L1.1 | 28.83,11.68 v28.83,14.35 | v12.19,23.37 12.28,23.28 14.22,23.28 | v20.19,35.05 20.29,34.96 20.58,34.96 21.12,34.42 21.12,33.65 18.41,30.95 18.41,24.13 17.57,23.28 14.22,23.28 | v20.19,18.41 v17.91,18.41 14.99,18.41 v14.35,18.41 | v14.22,21.21 14.22,23.28
  Bottom 0.381: v57.53,23.24 57.53,24.26 | v61.09,23.24 61.09,24.26 | 28.83,17.02 v28.83,14.35 | v7.11,18.41 7.11,15.88 8.13,14.86 13.46,14.86 v14.73,13.59
  Bottom 0.635: v32.26,8 v40.13,8 40.1,7.97 40.1,7.62 40.64,7.08 41.88,7.08 42.51,7.71 42.51,8.13 43.3,8.93 45.88,8.93 v46.23,9.27 | v12.19,23.37 11.68,23.37 11.27,23.78 11.27,29.37 v10.29,30.35 | 54.23,24.26 57.53,24.26 61.09,24.26 61.85,24.26 | 61.85,24.26 64.39,24.26 v65.41,23.24 | v61.85,30.73 61.85,24.26 | v50.16,22.23 33.02,22.23 28.83,18.03 | CON2.3 21.46,56.52 v19.56,54.61 | v20.19,35.05 18.92,35.05 15.49,38.48 14.86,38.48 v10.79,42.55 | v53.21,23.24 54.23,24.26 | v57.78,43.18 57.82,43.22 58.04,43.22 58.8,42.45 58.8,38.35 58.04,37.59 v57.78,37.59 57.78,33.78 55.15,31.15 55.12,31.15 54.58,30.61 54.58,30.57 v54.23,30.23 54.23,24.26 | 28.83,18.03 28.83,17.02 | v14.22,21.21 14.31,21.12 14.9,21.12 17.61,18.41 v17.91,18.41 | v20.19,18.41 28.45,18.41 28.83,18.03 | v14.35,18.41 v12.57,18.41 10.96,18.41 10.04,19.34 8.76,19.34 7.84,18.41 v7.11,18.41 v5.33,18.41
VEXT
  Top 0.635: D2.2 21.08,5.21 21.72,4.57 21.72,1.78 22.43,1.07 50.12,1.07 51.94,2.88 51.94,8 49.15,10.79 CON3.1

### Text on the board
bNames: + | - | + | D2 | D1 | A2+ | A1+ | GND | VOUT | GND | VIN | A2- | A1- | -